# Altium schematic sheet INA228.SchDoc
size A4; SheetNumber: 4; SheetTotal: 4
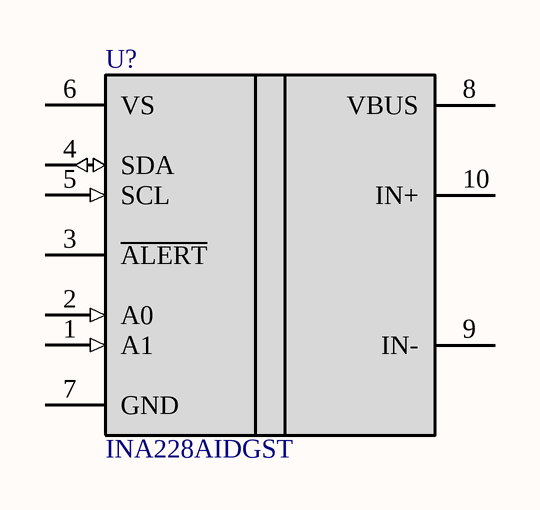
[diagram p0: INA228.SchDoc]

## Parts
U?  INA228AIDGST  [FP-DGS0010A-IPC_C]

## Nets

Not connected (* = marked no-connect by the designer): U? 1(A1) 2(A0) 3(~{ALERT}) 4(SDA) 5(SCL) 6(VS) 7(GND) 8(VBUS) 9(IN-) 10(IN+)

## Library data of the parts
U? = CMP-019-00049-1: IC PWR MONITOR 10VSSOP Power Supply Controller Digital Power Monitor 10-VSSOP